# Altium project LCDCommonBoard.PrjPCB
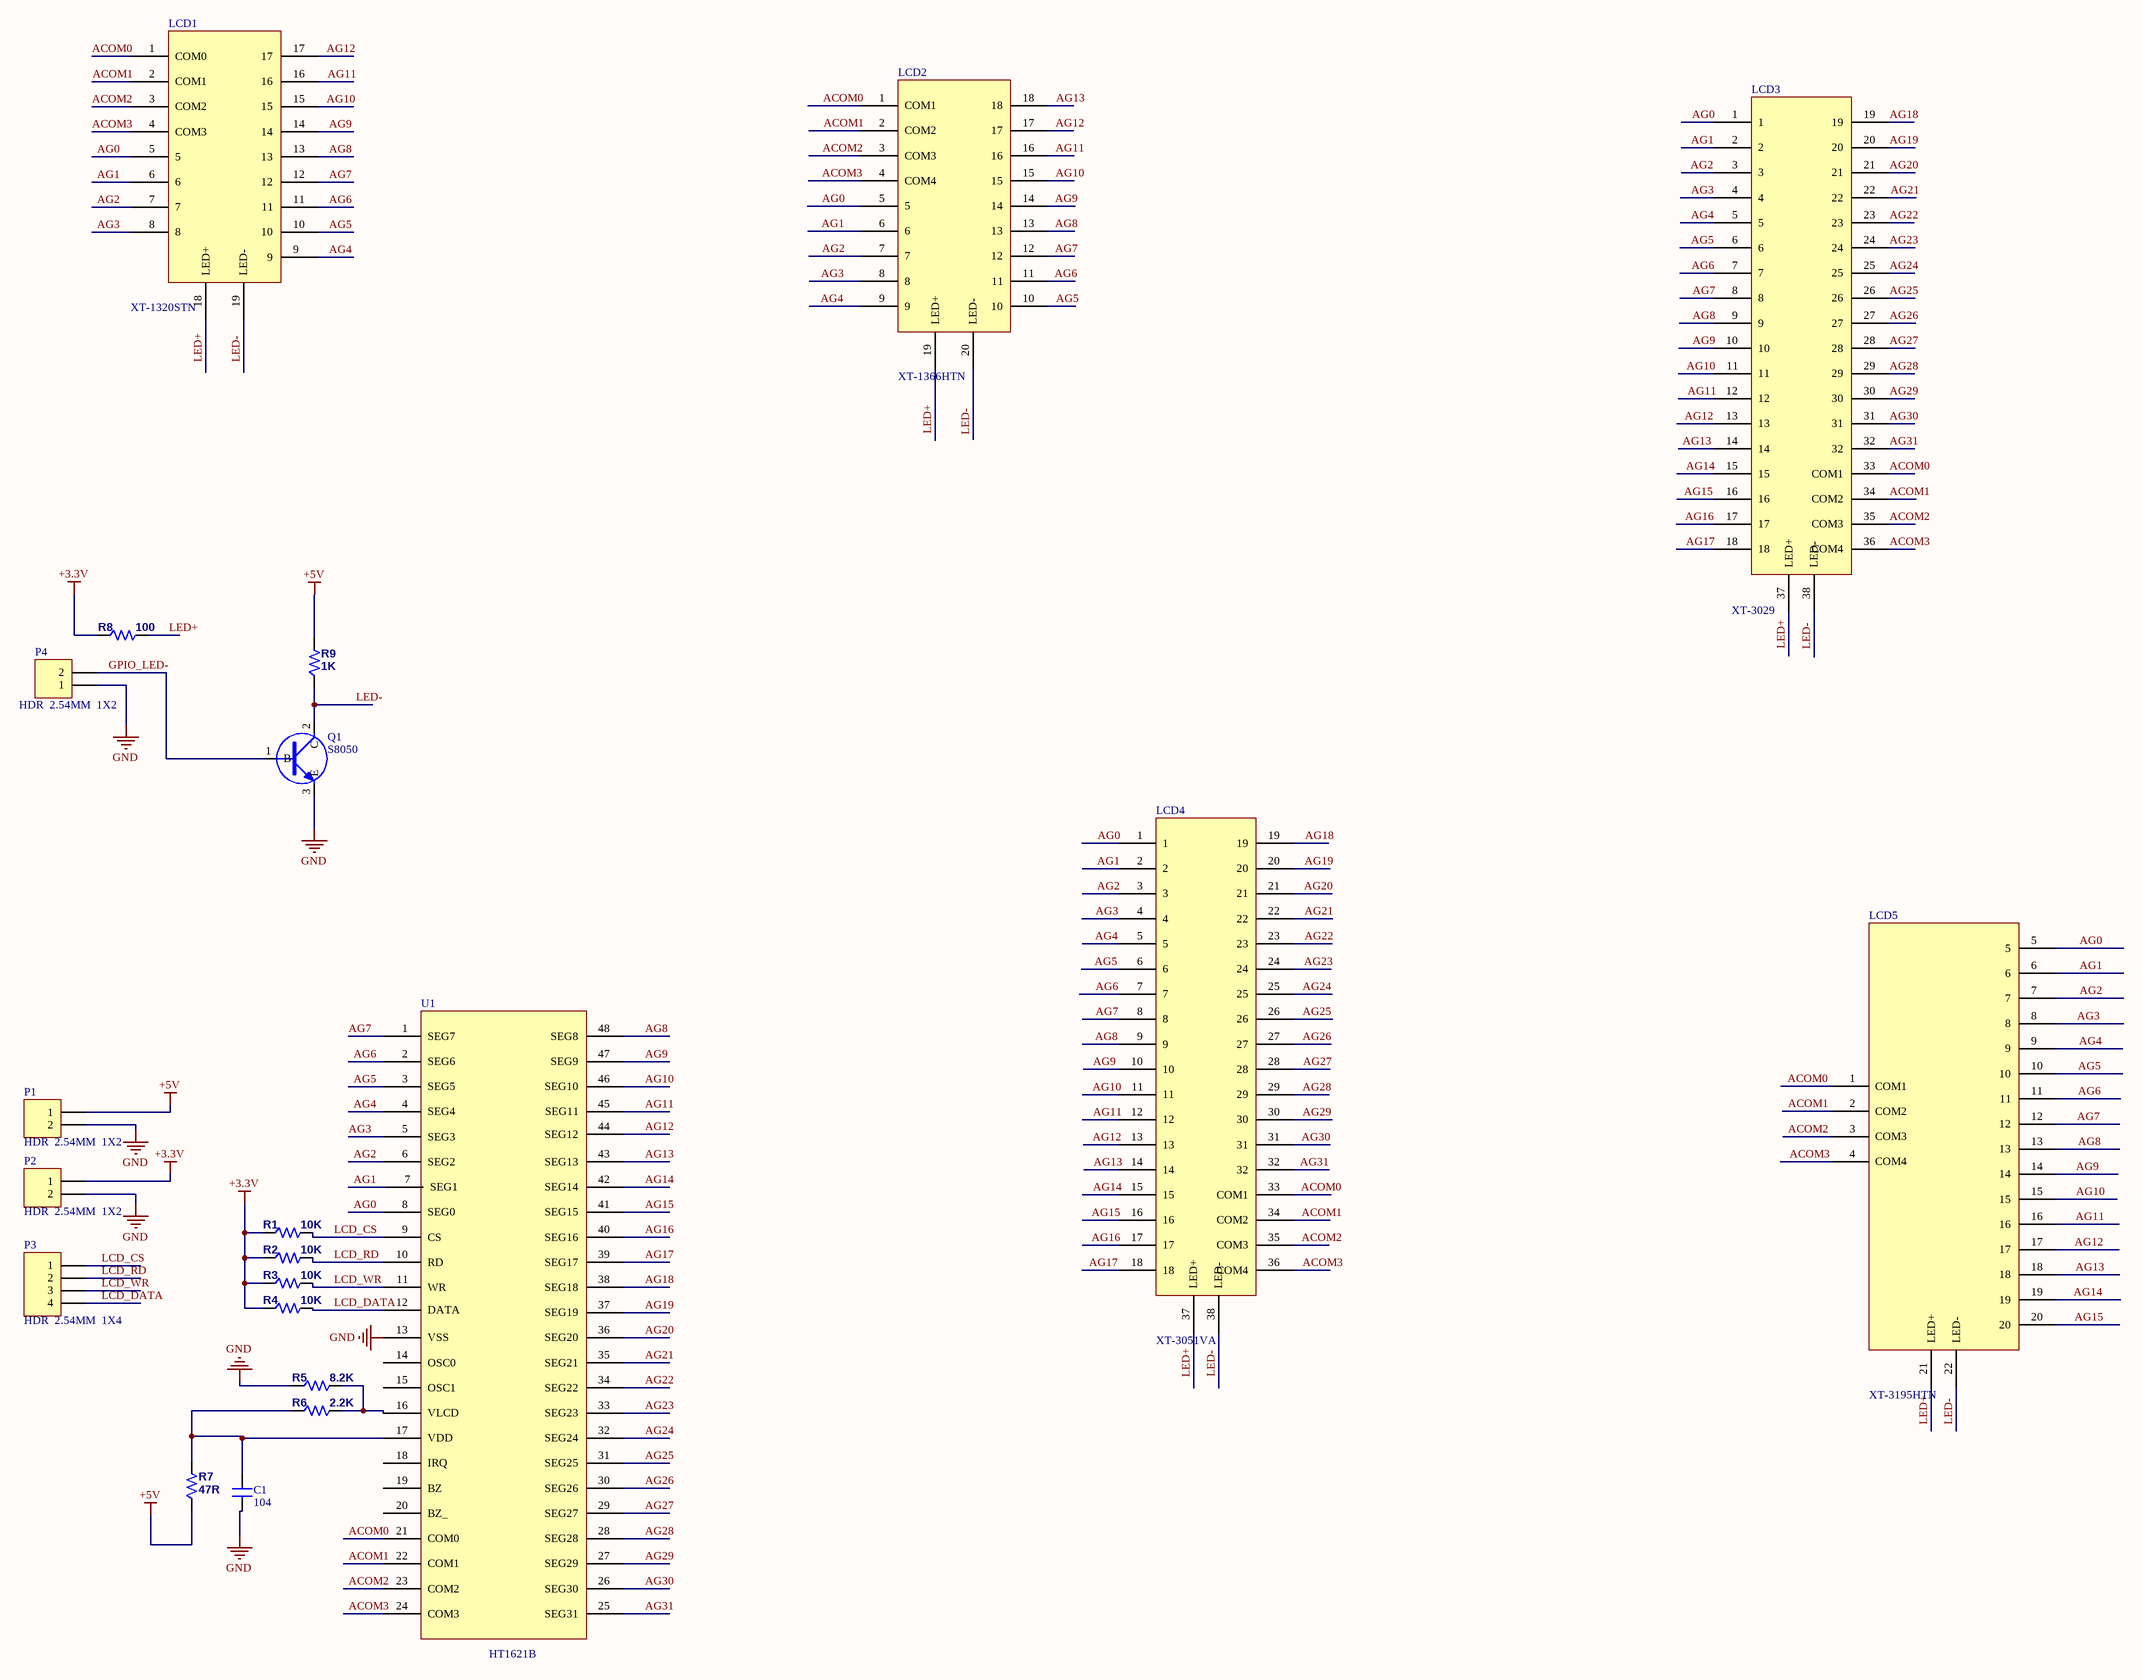
[diagram p0: LCDCommonBoard.SchDoc]
1 sheet, 21 parts. Net scope: global (net labels, ports and power ports of the same name join across sheets).
Board file: LCDDommonBoard.PcbDoc

## Sheet LCDCommonBoard.SchDoc
size A2

### Parts
C1  104  [C0603]
LCD1  XT-1320STN  [LCD_8+9PIN_21X22]
LCD2  XT-1366HTN  [LCD_18PIN_20X16]
LCD3  XT-3029  [LCD_36PIN_93X33]
LCD4  XT-3051VA  [LCD_36PIN_68x26.4]
LCD5  XT-3195HTN  [LCD_4+16PIN_15.5x22]
P1  HDR  2.54MM  1X2  [HDR-1x2]
P2  HDR  2.54MM  1X2  [HDR-1x2]
P3  HDR  2.54MM  1X4  [HDR-1X4]
P4  HDR  2.54MM  1X2  [HDR-1x2]
Q1  S8050  [SOT 23]
R1  10K  [R0603]
R2  10K  [R0603]
R3  10K  [R0603]
R4  10K  [R0603]
R5  8.2K  [R0603]
R6  2.2K  [R0603]
R7  47R  [R0603]
R8  100  [R0805]
R9  1K  [R0603]
U1  HT1621B  [SSOP-48]  (value not drawn)

### Nets
+3.3V: P2.1 R1.1 R2.1 R3.1 R4.1 R8.1
+5V: P1.1 R7.1 R9.2
GND: C1.2 P1.2 P2.2 P4.1 Q1.3(E) R5.1 U1.13(VSS)
ACOM0: LCD1.1(COM0) LCD2.1(COM1) LCD3.33(COM1) LCD4.33(COM1) LCD5.1(COM1) U1.21(COM0)
ACOM1: LCD1.2(COM1) LCD2.2(COM2) LCD3.34(COM2) LCD4.34(COM2) LCD5.2(COM2) U1.22(COM1)
ACOM2: LCD1.3(COM2) LCD2.3(COM3) LCD3.35(COM3) LCD4.35(COM3) LCD5.3(COM3) U1.23(COM2)
ACOM3: LCD1.4(COM3) LCD2.4(COM4) LCD3.36(COM4) LCD4.36(COM4) LCD5.4(COM4) U1.24(COM3)
AG0: LCD1.5 LCD2.5 LCD3.1 LCD4.1 LCD5.5 U1.8(SEG0)
AG1: LCD1.6 LCD2.6 LCD3.2 LCD4.2 LCD5.6 U1.7(SEG1)
AG2: LCD1.7 LCD2.7 LCD3.3 LCD4.3 LCD5.7 U1.6(SEG2)
AG3: LCD1.8 LCD2.8 LCD3.4 LCD4.4 LCD5.8 U1.5(SEG3)
AG4: LCD1.9 LCD2.9 LCD3.5 LCD4.5 LCD5.9 U1.4(SEG4)
AG5: LCD1.10 LCD2.10 LCD3.6 LCD4.6 LCD5.10 U1.3(SEG5)
AG6: LCD1.11 LCD2.11 LCD3.7 LCD4.7 LCD5.11 U1.2(SEG6)
AG7: LCD1.12 LCD2.12 LCD3.8 LCD4.8 LCD5.12 U1.1(SEG7)
AG8: LCD1.13 LCD2.13 LCD3.9 LCD4.9 LCD5.13 U1.48(SEG8)
AG9: LCD1.14 LCD2.14 LCD3.10 LCD4.10 LCD5.14 U1.47(SEG9)
AG10: LCD1.15 LCD2.15 LCD3.11 LCD4.11 LCD5.15 U1.46(SEG10)
AG11: LCD1.16 LCD2.16 LCD3.12 LCD4.12 LCD5.16 U1.45(SEG11)
AG12: LCD1.17 LCD2.17 LCD3.13 LCD4.13 LCD5.17 U1.44(SEG12)
AG13: LCD2.18 LCD3.14 LCD4.14 LCD5.18 U1.43(SEG13)
AG14: LCD3.15 LCD4.15 LCD5.19 U1.42(SEG14)
AG15: LCD3.16 LCD4.16 LCD5.20 U1.41(SEG15)
AG16: LCD3.17 LCD4.17 U1.40(SEG16)
AG17: LCD3.18 LCD4.18 U1.39(SEG17)
AG18: LCD3.19 LCD4.19 U1.38(SEG18)
AG19: LCD3.20 LCD4.20 U1.37(SEG19)
AG20: LCD3.21 LCD4.21 U1.36(SEG20)
AG21: LCD3.22 LCD4.22 U1.35(SEG21)
AG22: LCD3.23 LCD4.23 U1.34(SEG22)
AG23: LCD3.24 LCD4.24 U1.33(SEG23)
AG24: LCD3.25 LCD4.25 U1.32(SEG24)
AG25: LCD3.26 LCD4.26 U1.31(SEG25)
AG26: LCD3.27 LCD4.27 U1.30(SEG26)
AG27: LCD3.28 LCD4.28 U1.29(SEG27)
AG28: LCD3.29 LCD4.29 U1.28(SEG28)
AG29: LCD3.30 LCD4.30 U1.27(SEG29)
AG30: LCD3.31 LCD4.31 U1.26(SEG30)
AG31: LCD3.32 LCD4.32 U1.25(SEG31)
GPIO_LED-: P4.2 Q1.1(B)
LCD_CS: P3.1 R1.2 U1.9(CS)
LCD_DATA: P3.4 R4.2 U1.12(DATA)
LCD_RD: P3.2 R2.2 U1.10(RD)
LCD_WR: P3.3 R3.2 U1.11(WR)
LED+: LCD1.18(LED+) LCD2.19(LED+) LCD3.37(LED+) LCD4.37(LED+) LCD5.21(LED+) R8.2
LED-: LCD1.19(LED-) LCD2.20(LED-) LCD3.38(LED-) LCD4.38(LED-) LCD5.22(LED-) Q1.2(C) R9.1
NetC1_1: C1.1 R6.1 R7.2 U1.17(VDD)
NetR5_2: R5.2 R6.2 U1.16(VLCD)

Not connected (* = marked no-connect by the designer): U1 14(OSC0) 15(OSC1) 18(IRQ) 19(BZ) 20(BZ_)

### Library data of the parts
C1 = CAP1_60: 查不到; 加工方式: 贴片
P1 P2 P4 = HDR  2.54MM  1X2: 仓库名称: 五金仓; 加工方式: 插件; 规格型号: *; 物料名称: *; 助记码: *; 单位: *; 备注: *; 物料代码: *
P3 = HDR  2.54MM  1X4: 仓库名称: 五金仓; 加工方式: 插件; 规格型号: *; 助记码: *; 单位: *; 备注: *; 物料代码: *; 物料名称: *
Q1 = NPN  东芝管2SA5200: 物料代码: 3.01.18.0008; 仓库名称: 元件仓; 助记码: DZG2SA5200; 单位: 只; 加工方式: 插件; 物料名称: 东芝管2SA5200
R1-R9 = RES1: 1206  K  5%  HS  贴片电阻